# Altium schematic sheet Timer555.SchDoc
size A4; SheetNumber: 3; SheetTotal: 5
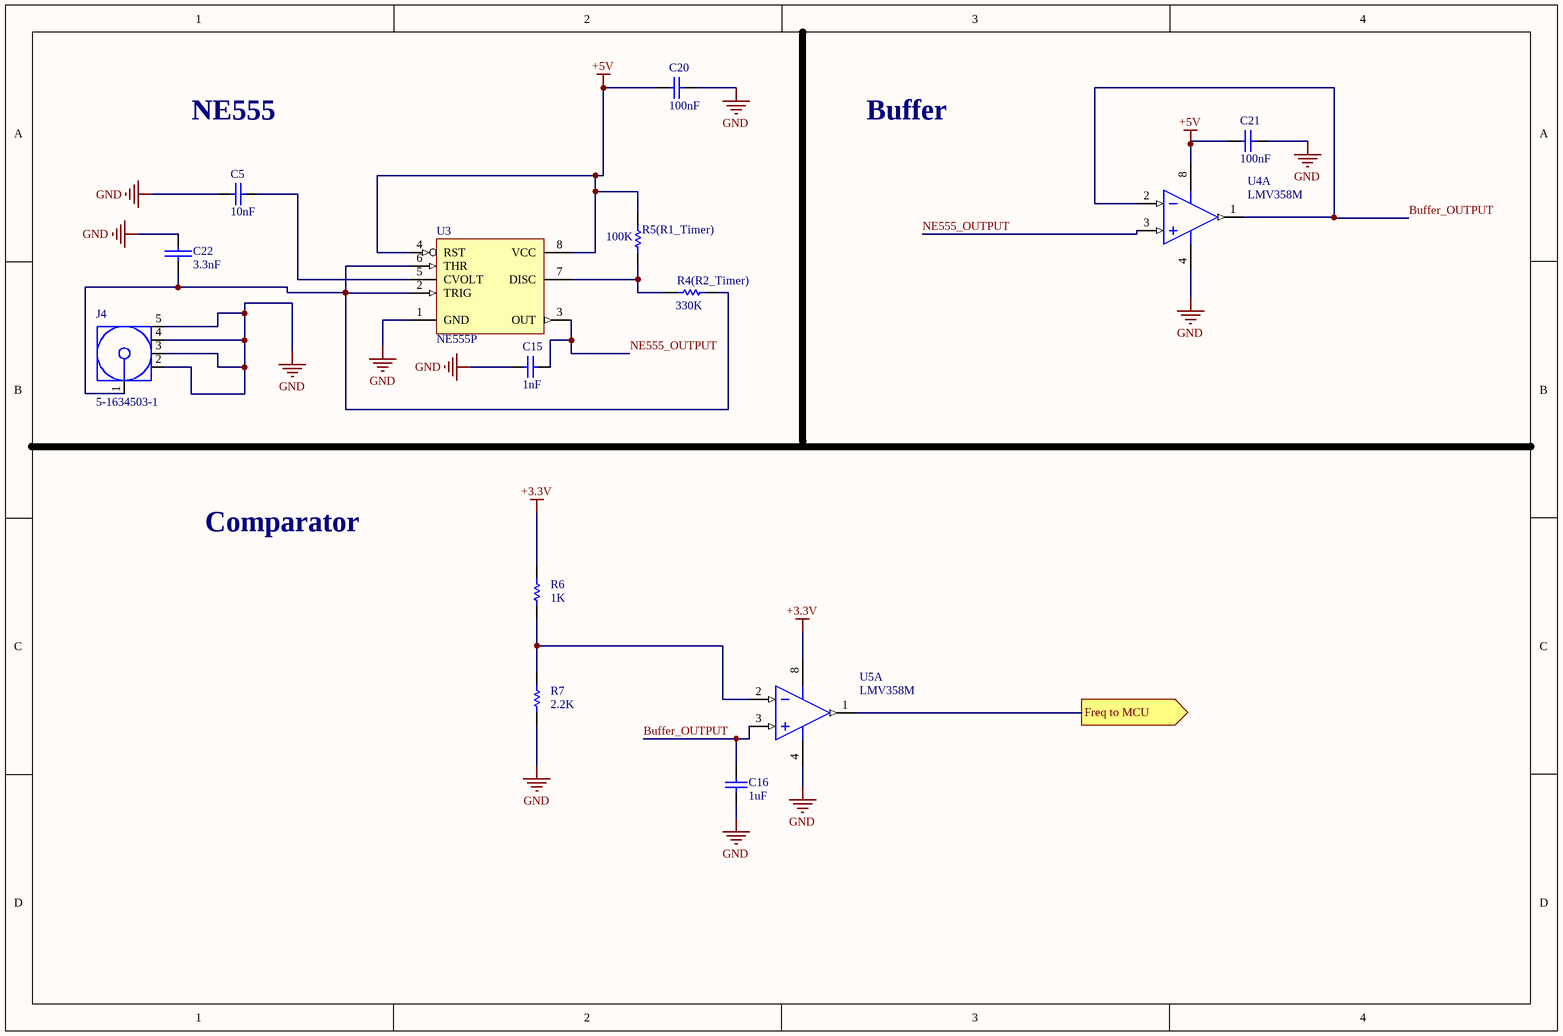
[diagram p0: Timer555.SchDoc]

## Parts
C5  10nF  [CAPC2012N (0805)]
C15  1nF  [CAPC3216M (1206)]
C16  1uF  [CAPC3216M (1206)]
C20  100nF  [CAPC2012N (0805)]
C21  100nF  [CAPC2012N (0805)]
C22  3.3nF  [Cap - 100nF]
J4  5-1634503-1  [TECO-5-1634503-1_V]
R4(R2_Timer)  330K  [Res-(1/2)]
R5(R1_Timer)  100K  [Res-(1/2)]
R6  1K  [RESC3216X60L (1206)]
R7  2.2K  [RESC3216X60L (1206)]
U3  NE555P  [P008]
U4  LMV358M  [M08A_M]  (part A of 2)
U5  LMV358M  [M08A_M]  (part A of 2)

## Ports
Freq to MCU (out)

## Nets
+3.3V: R6.2 U5.8(V+)
+5V: C20.1(+) C21.1(+) R5(R1_Timer).2 U3.4(RST) U3.8(VCC) U4.8(V+)
GND: C5.1(+) C15.1(+) C16.2(-) C20.2(-) C21.2(-) C22.1(+) J4.2 J4.3 J4.4 J4.5 R7.1 U3.1(GND) U4.4(V-) U5.4(V-)
Buffer_OUTPUT: C16.1(+) U4.1(OUTA) U4.2(INA-) U5.3(INA+)
Freq to MCU: U5.1(OUTA) ; port Freq to MCU
NE555_OUTPUT: C15.2(-) U3.3(OUT) U4.3(INA+)
NetC5_2: C5.2(-) U3.5(CVOLT)
NetC22_2: C22.2(-) J4.1 R4(R2_Timer).2 U3.2(TRIG) U3.6(THR)
NetR4(R2_Timer)_1: R4(R2_Timer).1 R5(R1_Timer).1 U3.7(DISC)
NetR6_1: R6.1 R7.2 U5.2(INA-)

## Notes on the sheet
- NE555
- Buffer
- Comparator

## Library data of the parts
C5 C15 C16 C20 C21 = CAP_Bipolar: Bipolar Capacitor; Voltage: 100V; Designer: Eng. Saeid Jorablo; Company: SJ Libraries; ComponentLink1Description: Datasheet; ComponentLink2Description: Reference; Publisher: SJ Unlimited; Mounting Technology: *; Mounting Technology: Surface Mount\Through-Hole; HelpURL: http://s3.picofile.com/file/7443264187/Coming_Soon_logo.gif; Status: Unreleased
  C5: Value: 10nF
  C15: Value: 1nF
  C16: Value: 1uF
  C20 C21: Value: 100nF
C22 = Cap-Bipolar: Bipolar Capacitor; Voltage: 100V; Designer: Saeid Jorablo; Organazation: ControTec; Adding Date: 1387/12/20; Value: 3.3nF
J4 = 5-1634503-1: Female Header, Pitch 3.13 mm, Height 13.7 mm, Tail Length 4.5 mm, -55 to 85 degC, RoHS, Bulk; Manufacturer: TE Connectivity; Coaxial Termination: Solder; Frequency Max: 2GHz; Connector Type: BNCCoaxial; SVHC: NoSVHC(15-Jun-2015); Connector Body Style: StraightJack; Impedance: 50ohm; Connector Mounting: PCBMount; Manufacturer URL: http://www.te.com/; Coaxial Cable Types: -; Datasheet Version: Rev. E, 02/2012; Datasheet URL: http://www.mouser.com/ds/2/418/NG_CD_1634503_E-657474.pdf; Product Range: -; Contact Plating: GoldPlatedContacts; Mounting Technology: ThroughHole; Contact Material: Brass; Package Description: Female Header, Pitch 3.13 mm, Height 13.7 mm, Tail Length 4.5 mm; Package Reference: 5-1634503-1; PartNumber: 5-1634503-1
R4(R2_Timer) R5(R1_Timer) R7 = RES: Resistor; Designer: Eng. Saeid Jorablo; Company: SJ Libraries; Tolerance: 5%; Power: 1/8 W; Value: 1K; Category: Resistors; ComponentLink1Description: Datasheet; ComponentLink2Description: Reference; PackageDescription: SMD & TH Resistors; Publisher: SJ Unlimited; Mounting Technology: Surface Mount\Through-Hole; HelpURL: http://s3.picofile.com/file/7443264187/Coming_Soon_logo.gif; Status: Unreleased
R6 = RES: Resistor; Designer: Eng. Saeid Jorablo; Company: SJ Libraries; Tolerance: 5%; Power: 1/8 W; Category: Resistors; ComponentLink1Description: Datasheet; ComponentLink2Description: Reference; PackageDescription: SMD & TH Resistors; Publisher: SJ Unlimited; Mounting Technology: Surface Mount\Through-Hole; HelpURL: http://s3.picofile.com/file/7443264187/Coming_Soon_logo.gif; Status: Unreleased; Value: 1K
U3 = NE555P: Precision Timer; Published: 16-Jan-2001; LatestRevisionDate: 04-Mar-2005; LatestRevisionNote: Stylized 3D Model Added.; DatasheetVersion: Feb-1992; PackageVersion: Jun-1999; PackageReference: P008; Publisher: Altium Limited; PackageDescription: DIP; 8 Leads; Row Spacing 7.62 mm; Pitch 2.54 mm; Code_JEDEC: MO-001-AN; ComponentLink1Description: Manufacturer Link; ComponentLink1URL: http://www.ti.com/; ComponentLink2Description: Datasheet; ComponentLink2URL: http://www-s.ti.com/sc/ds/ne555.pdf
U4 U5 = LMV358M: General Purpose, Low Voltage, Rail-to-Rail Output Operational Amplifiers, 8-pin Narrow SOIC; Manufacturer: National Semiconductor; PackageTopMarking: NSZXTT*LMV*358M; PowerWise: N; PinCount: 8; DatasheetVersion: Sep-2009; Code_JEDEC: MS-012-AA; Code_IPC: SOIC127P600-8; PackageVersion: revM, May-2009; PackageReference: M08A; PackageDescription: SOIC Narrow, 4.9 x 3.9 x 1.45mm, 8 Lead, 1.27mm Pitch; CompType: Amplifiers; RoHS: N; PartNumber: LMV358M